# EAGLE design ArgentINOedge_v2 (EAGLE 6.6.0)
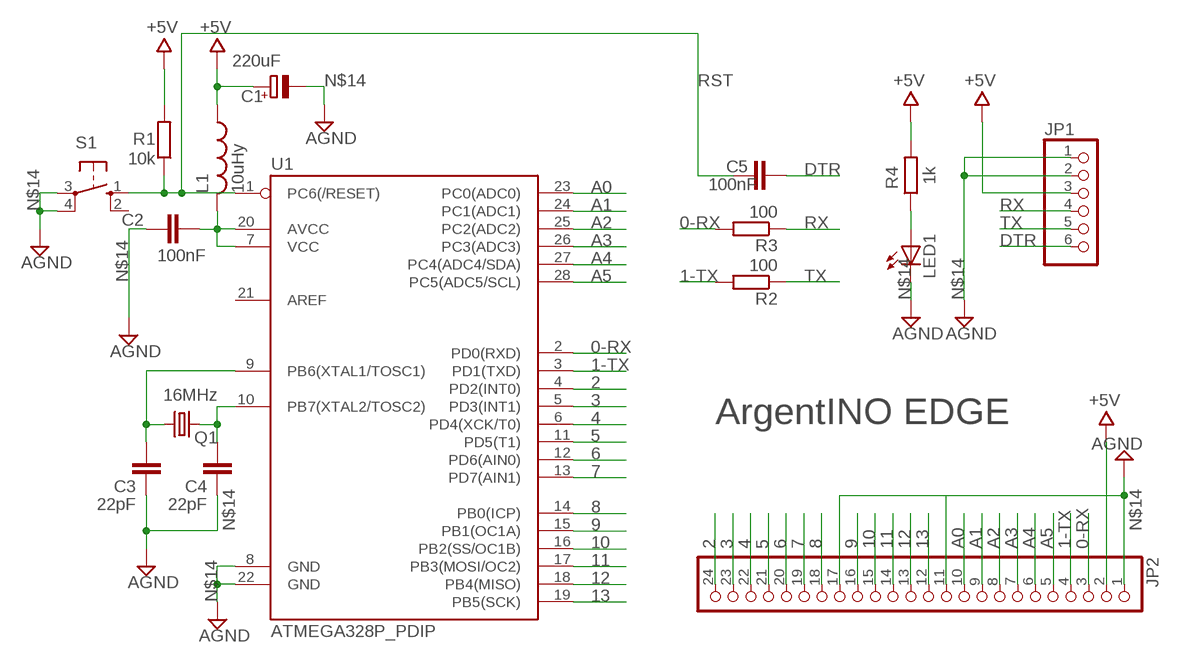
[diagram p0: schematic, sheet 1]

## Parts
C1  220uF  CPOL-EUE3.5-8  [E3,5-8]
C2  100nF  C-EU050-024X044  [C050-024X044]
C3  22pF  C-EU025-025X050  [C025-025X050]
C4  22pF  C-EU025-025X050  [C025-025X050]
C5  100nF  C-EU050-024X044  [C050-024X044]
JP1  PINHD-1X6  [1X06]
JP2  PINHD-1X24  [1X24]
L1  10uHy  L-US0204/7  [0204/7]
LED1  LED3MM  [LED3MM]
Q1  16MHz  CRYSTALHC49S  [HC49/S]
R1  10k  R-EU_0204/7  [0204/7]
R2  100  R-EU_0204/7  [0204/7]
R3  100  R-EU_0204/7  [0204/7]
R4  1k  R-EU_0204/7  [0204/7]
S1  10-XX  [B3F-10XX]
U1  ATMEGA328P_PDIP  [DIL28-3]

## Nets
0-RX: JP2.3 R3.2 U1.2(PD0(RXD))
1-TX: JP2.4 R2.2 U1.3(PD1(TXD))
2: JP2.24 U1.4(PD2(INT0))
3: JP2.23 U1.5(PD3(INT1))
4: JP2.22 U1.6(PD4(XCK/T0))
5: JP2.21 U1.11(PD5(T1))
6: JP2.20 U1.12(PD6(AIN0))
7: JP2.19 U1.13(PD7(AIN1))
8: JP2.18 U1.14(PB0(ICP))
9: JP2.16 U1.15(PB1(OC1A))
10: JP2.15 U1.16(PB2(SS/OC1B))
11: JP2.14 U1.17(PB3(MOSI/OC2))
12: JP2.13 U1.18(PB4(MISO))
13: JP2.12 U1.19(PB5(SCK))
+5V: C1.+ JP1.3 JP2.2 L1.1 R1.2 R4.2
A0: JP2.10 U1.23(PC0(ADC0))
A1: JP2.9 U1.24(PC1(ADC1))
A2: JP2.8 U1.25(PC2(ADC2))
A3: JP2.7 U1.26(PC3(ADC3))
A4: JP2.6 U1.27(PC4(ADC4/SDA))
A5: JP2.5 U1.28(PC5(ADC5/SCL))
DTR: C5.1 JP1.6
N$1: C3.2 Q1.2 U1.9(PB6(XTAL1/TOSC1))
N$2: C4.2 Q1.1 U1.10(PB7(XTAL2/TOSC2))
N$3: C2.1 L1.2 U1.7(VCC) U1.20(AVCC)
N$14: C1.- C2.2 C3.1 C4.1 JP1.1 JP1.2 JP2.1 JP2.11 JP2.17 LED1.K(C) S1.3(P) S1.4(P1) U1.8(GND) U1.22(GND) ; supply symbol labelled AGND
N$40: LED1.A R4.1
RST: C5.2 R1.1 S1.1(S) U1.1(PC6(/RESET))
RX: JP1.4 R3.1
TX: JP1.5 R2.1
Unconnected: S1.2(S1) U1.21(AREF)

## Notes on the sheet
- ArgentINO EDGE

## Library data of the parts
C1 = rcl:CPOL-EU: POLARIZED CAPACITOR, European symbol
C2-C5 = rcl:C-EU: CAPACITOR, European symbol
JP1 = pinhead:PINHD-1X6: PIN HEADER
JP2 = pinhead:PINHD-1X24: PIN HEADER
L1 = rcl:L-US: INDUCTOR, American symbol
LED1 = led:LED: LED OSRAM: - CHIPLED LG R971, LG N971, LY N971, LG Q971, LY Q971, LO R971, LY R971 LH N974, LH R974 LS Q976, LO Q976, LY Q976 LO Q996 - Hyper CHIPLED LW Q18S LB Q993, LB Q99A, LB R99A - SideLED LS A670, LO A670, LY A670, LG A670, LP A670 LB A673, LV A673, LT A673, LW A673 LH A674 LY A675 LS A676, LA A676, LO A676, LY A676, LW A676 LS A679, LY A679, LG A679 - Hyper Micro SIDELED® LS Y876, LA Y876, LO Y876, LY Y876 LT Y87S - SmartLED LW L88C, LW L88S LB L89C, LB L89S, LG L890 LS L89K, LO L89K, LY L89K LS L896, LA L896, LO L896, LY L896 - TOPLED LS T670, LO T670, LY T670, LG T670, LP T670 LSG T670, LSP T670, LSY T670, LOP T670, LYG T670 LG T671, LOG T671, LSG T671 LB T673, LV T673, LT T673, LW T673 LH T674 LS T676, LA T676, LO T676, LY T676, LB T676, LH T676, LSB T676, LW T676 LB T67C, LV T67C, LT T67C, LS T67K, LO T67K, LY T67K, LW E67C LS E67B, LA E67B, LO E67B, LY E67B, LB E67C, LV E67C, LT E67C LW T67C LS T679, LY T679, LG T679 LS T770, LO T770, LY T770, LG T770, LP T770 LB T773, LV T773, LT T773, LW T773 LH T774 LS E675, LA E675, LY E675, LS T675 LS T776, LA T776, LO T776, LY T776, LB T776 LHGB T686 LT T68C, LB T68C - Hyper Mini TOPLED® LB M676 - Mini TOPLED Santana® LG M470 LS M47K, LO M47K, LY M47K Source: http://www.osram.convergy.de LUXEON: - LUMILED® LXK2-PW12-R00, LXK2-PW12-S00, LXK2-PW14-U00, LXK2-PW14-V00 LXK2-PM12-R00, LXK2-PM12-S00, LXK2-PM14-U00 LXK2-PE12-Q00, LXK2-PE12-R00, LXK2-PE12-S00, LXK2-PE14-T00, LXK2-PE14-U00 LXK2-PB12-K00, LXK2-PB12-L00, LXK2-PB12-M00, LXK2-PB14-N00, LXK2-PB14-P00, LXK2-PB14-Q00 LXK2-PR12-L00, LXK2-PR12-M00, LXK2-PR14-Q00, LXK2-PR14-R00 LXK2-PD12-Q00, LXK2-PD12-R00, LXK2-PD12-S00 LXK2-PH12-R00, LXK2-PH12-S00 LXK2-PL12-P00, LXK2-PL12-Q00, LXK2-PL12-R00 Source: www.luxeon.com KINGBRIGHT: KA-3528ASYC Source: www.kingbright.com
Q1 = crystal:CRYSTAL: CRYSTAL; OC_FARNELL: 1667008; OC_NEWARK: unknown
R1-R4 = rcl:R-EU_: RESISTOR, European symbol
S1 = switch-omron:10-XX: OMRON SWITCH; MPN: B3F-1000; OC_FARNELL: 176432; OC_NEWARK: 36M3542
U1 = SparkFun-DigitalIC:ATMEGA328P_PDIP: uC used in the Arduino 32kb flash, 1k EEPROM, 2k SRAM This is the through-hole version of this chip.

## Board
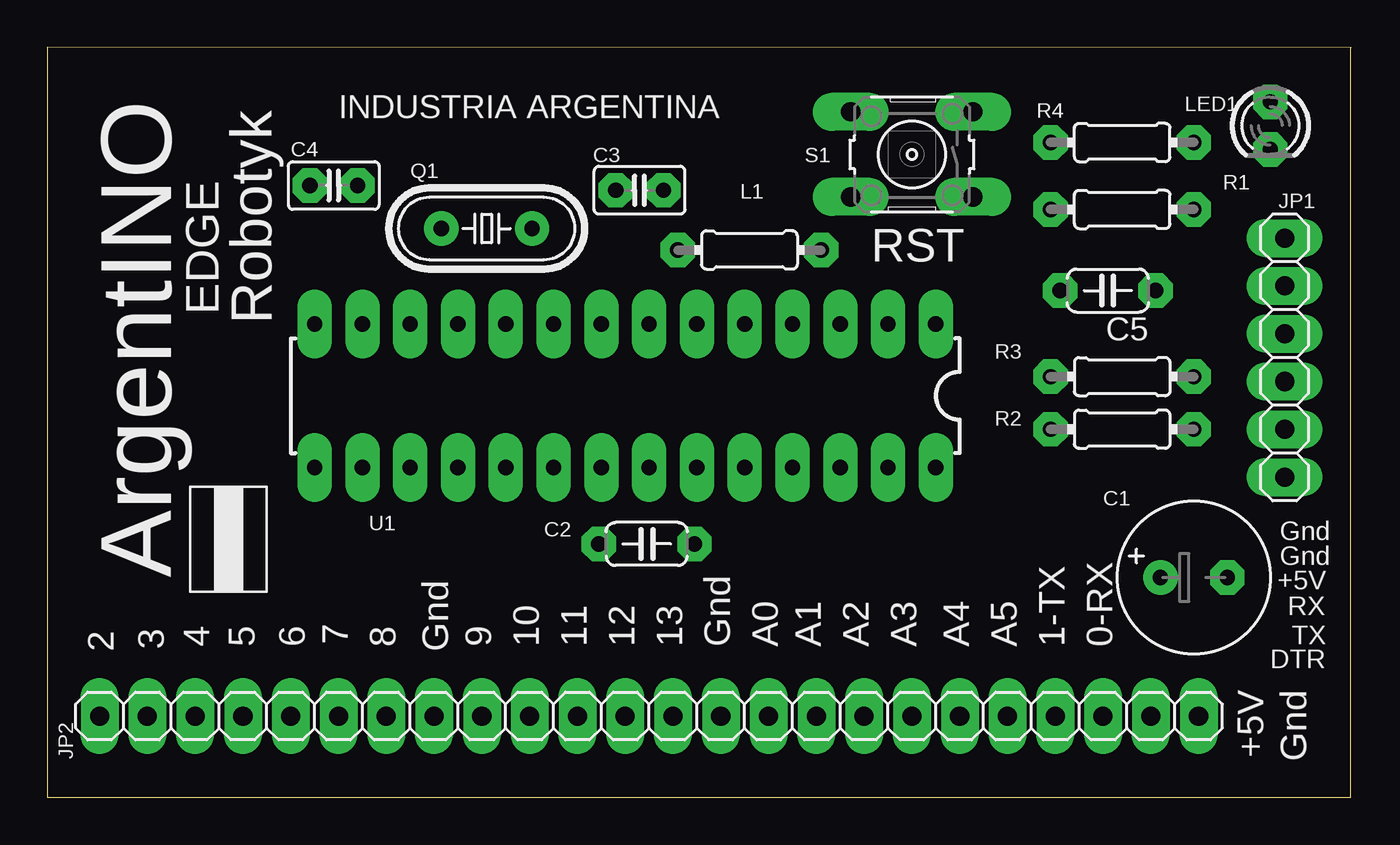
[diagram p1: board, top side]
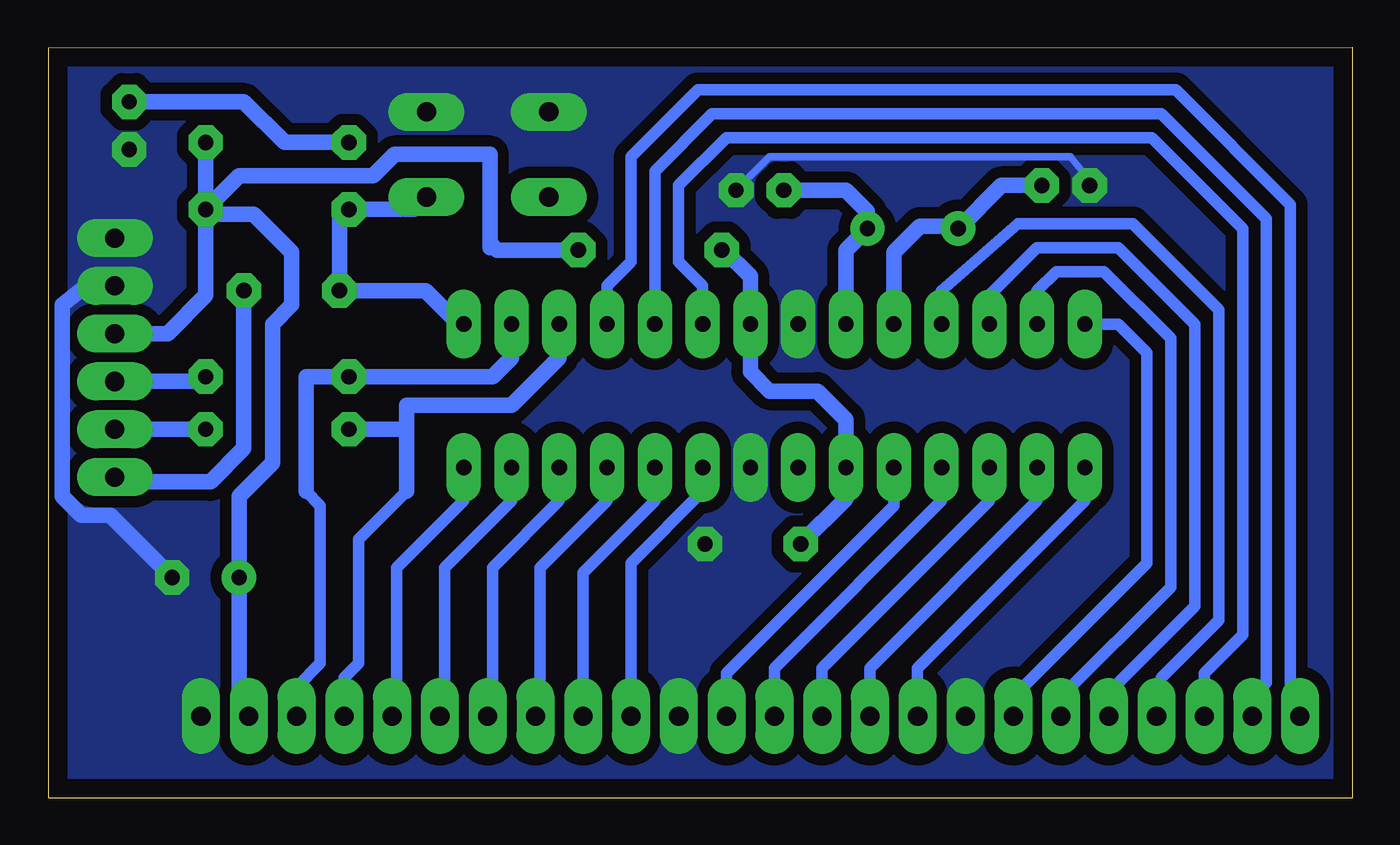
[diagram p2: board, bottom side, seen from below]

Size 69.32 x 39.88 mm. Coordinates in mm from the lower left corner, seen from the top.
Outline: 69.3,39.85 69.3,0 0,0 0,39.88 69.32,39.85
Copper layers (1*16): Top 0.035mm / dielectric 1.5mm / Bottom 0.035mm
Design rules "default *": minimum track width 10mil, minimum drill 24mil, track to track 8mil, track to pad 8mil, pad to pad 8mil, via to via 8mil, smd to smd 8mil, copper to edge 40mil, drill to drill 8mil, minimum pad ring 20mil, minimum via ring 8mil, stop-mask expansion 4mil, vias tented up to drill 0mil, thermal gap 20mil

### Footprints (pad centres in the part's own frame; a part is rotated, then mirrored left to right if it is on the bottom)
E3,5-8 = drill 0.813 pad 1.6: + -1.778,0 | drill 0.813 pad 1.6 octagon: - 1.778,0
C050-024X044 = drill 0.813 octagon: 1 -2.54,0; 2 2.54,0
C025-025X050 = drill 0.813 octagon: 1 -1.27,0; 2 1.27,0
1X06 = drill 1.016 long: 1 -6.35,0; 2 -3.81,0; 3 -1.27,0; 4 1.27,0; 5 3.81,0; 6 6.35,0
1X24 = drill 1.016 long: 1 -29.21,0; 2 -26.67,0; 3 -24.13,0; 4 -21.59,0; 5 -19.05,0; 6 -16.51,0; 7 -13.97,0; 8 -11.43,0; 9 -8.89,0; 10 -6.35,0; 11 -3.81,0; 12 -1.27,0; 13 1.27,0; 14 3.81,0; 15 6.35,0; 16 8.89,0; 17 11.43,0; 18 13.97,0; 19 16.51,0; 20 19.05,0; 21 21.59,0; 22 24.13,0; 23 26.67,0; 24 29.21,0
0204/7 = drill 0.813 octagon: 1 -3.81,0; 2 3.81,0
LED3MM = drill 0.813 octagon: A -1.27,0; K 1.27,0
HC49/S = drill 0.813: 1 -2.413,0; 2 2.413,0
B3F-10XX = drill 1.016 long: 1 -3.251,2.261; 2 3.251,2.261; 3 -3.251,-2.261; 4 3.251,-2.261
DIL28-3 = drill 0.813 long: 1 -16.51,-3.81; 2 -13.97,-3.81; 3 -11.43,-3.81; 4 -8.89,-3.81; 5 -6.35,-3.81; 6 -3.81,-3.81; 7 -1.27,-3.81; 8 1.27,-3.81; 9 3.81,-3.81; 10 6.35,-3.81; 11 8.89,-3.81; 12 11.43,-3.81; 13 13.97,-3.81; 14 16.51,-3.81; 15 16.51,3.81; 16 13.97,3.81; 17 11.43,3.81; 18 8.89,3.81; 19 6.35,3.81; 20 3.81,3.81; 21 1.27,3.81; 22 -1.27,3.81; 23 -3.81,3.81; 24 -6.35,3.81; 25 -8.89,3.81; 26 -11.43,3.81; 27 -13.97,3.81; 28 -16.51,3.81

### Placement (x,y rotation side)
C1  60.96,11.69 0 top
C2  31.88,13.47 0 top
C3  31.5,32.27 180 top
C4  15.24,32.52 0 top
C5  56.39,26.93 180 top
JP1  65.79,23.38 270 top
JP2  32,4.33 180 top
L1  37.34,29.09 180 top
LED1  65.02,35.7 270 top
Q1  23.37,30.24 0 top
R1  57.15,31.25 0 top
R2  57.15,19.57 180 top
R3  57.15,22.36 180 top
R4  57.15,34.81 0 top
S1  45.97,34.17 180 top
U1  30.73,21.35 180 top

### Tracks (layer width: path | path; a pad name or v marks a point on that pad's centre or on a via)
0-RX
  Bottom 0.61: 55.63,16.27 54.86,15.5 54.86,7.12 56.13,5.85 JP2.3
  Bottom 0.813: U1.2 44.7,23.38 45.72,22.36 R3.2 55.63,22.36 55.63,16.27
1-TX
  Bottom 0.61: JP2.4 53.59,6.36 52.83,7.12 52.83,13.73 50.29,16.27
  Bottom 0.813: U1.3 42.16,23.38 44.7,20.84 50.29,20.84 50.29,19.57 | 50.29,19.57 R2.2 | 50.29,16.27 50.29,19.57
2
  Bottom 0.61: U1.4 39.62,27.19 38.35,28.46 38.35,34.05 34.8,37.6 9.4,37.6 3.3,31.51 3.3,5.85 2.79,5.34 JP2.24
3
  Bottom 0.61: JP2.23 5.59,5.34 4.57,6.11 4.57,30.74 10.16,36.33 34.04,36.33 37.08,33.28 U1.5
4
  Bottom 0.61: JP2.22 7.87,6.61 5.84,8.65 5.84,30.24 10.67,35.06 33.27,35.06 35.81,32.52 35.81,28.46 34.54,27.19 U1.6
5
  Bottom 0.61: U1.11 21.84,26.93 17.78,30.49 11.68,30.49 7.11,25.92 7.11,9.41 10.16,6.36 10.41,5.6 JP2.21
6
  Bottom 0.61: U1.12 19.3,26.68 16.76,29.22 12.45,29.22 8.38,25.16 8.38,10.17 12.95,5.6 JP2.20
7
  Bottom 0.61: U1.13 16.76,26.93 15.75,27.95 13.21,27.95 9.65,24.39 9.65,11.19 15.49,5.34 JP2.19
8
  Bottom 0.61: U1.14 12.45,25.16 10.92,23.63 10.92,12.46 18.03,5.34 JP2.18
9
  Bottom 0.61: U1.15 14.22,15.76 23.11,6.87 JP2.16
10
  Bottom 0.61: U1.16 16.76,15.76 25.65,6.87 JP2.15
11
  Bottom 0.61: U1.17 19.3,15.76 28.19,6.87 JP2.14
12
  Bottom 0.61: U1.18 21.84,15.76 30.73,6.87 JP2.13
13
  Bottom 0.61: U1.19 24.38,15.5 33.27,6.61 JP2.12
+5V
  Bottom 0.813: R4.2 R1.2 | 45.85,29.22 45.85,29.47 | 45.85,29.47 45.85,34.17 50.93,34.17 52.07,33.03 59.18,33.03 R1.2 | L1.1 45.47,29.09 45.85,29.47 | JP2.2 59.18,4.84 C1.+ 59.18,16.01 57.4,17.79 57.4,25.16 56.39,26.17 56.39,28.97 58.42,31 60.71,31 R1.2 | JP1.3 62.99,24.65 60.96,26.68 R1.2
A0
  Bottom 0.61: U1.23 34.54,16.27 38.35,12.46 JP2.10
A1
  Bottom 0.61: U1.24 37.08,15.76 40.89,11.95 JP2.9
A2
  Bottom 0.61: U1.25 39.62,15.76 43.18,12.2 43.18,4.58 JP2.8
A3
  Bottom 0.61: U1.26 42.16,15.76 45.72,12.2 45.72,4.58 JP2.7
A4
  Bottom 0.61: U1.27 44.7,15.76 48.26,12.2 48.26,4.58 JP2.6
A5
  Bottom 0.61: U1.28 47.24,15.76 50.8,12.2 50.8,4.58 JP2.5
DTR
  Bottom 0.813: C5.1 58.93,18.55 60.71,16.77 65.53,16.77 JP1.6
N$1
  Bottom 0.813: C3.2 26.92,32.27 25.78,31.12 Q1.2 26.92,29.09 U1.9
N$2
  Bottom 0.61: Q1.1 20.95,30.36
  Bottom 0.813: 20.95,30.36 22.99,30.36 24.38,28.97 U1.10 | C4.2 18.67,32.52 Q1.1
N$3
  Bottom 0.813: L1.2 33.4,29.09 32,27.7 U1.7 32,22.62 30.99,21.6 28.45,21.6 26.92,20.08 U1.20 26.92,15.88 C2.1
N$14
  Bottom 0.406: C4.1 13.97,32.78 14.99,34.05 30.99,34.05 C3.1
  Bottom 0.813: JP1.2 67.31,27.19 68.58,26.17 68.58,16.01 67.56,15 66.04,15 C1.-
  pour Bottom (isolate 0.61, no thermals): 0,39.76 69.21,39.76 69.21,0.01 0,0.01
N$40
  Bottom 0.813: R4.1 56.77,34.81 58.93,36.97 LED1.A
RST
  Bottom 0.813: U1.1 47.5,25.16 49.28,26.93 C5.2 53.85,30.74 R1.1 49.89,31.25 S1.1
RX
  Bottom 0.813: JP1.4 60.96,22.11 R3.1
S$1
  Bottom 0.61: 50.8,4.58 51.05,4.33
S$4
  Bottom 0.61: 33.27,4.33 33.27,6.36
S$10
  Bottom 0.61: 48.26,4.58 48.51,4.33
S$16
  Bottom 0.61: 43.18,4.58 43.43,4.33
S$18
  Bottom 0.61: 45.72,4.58 45.97,4.33
TX
  Bottom 0.813: JP1.5 R2.1

### Text on the board
tNames: INDUSTRIA ARGENTINA | RST | EDGE | Robotyk | Gnd | Gnd | ArgentINO | +5V | RX | TX | 2 | 3 | 4 | 5 | 6 | 7 | 8 | Gnd | 9 | 10 | 11 | 12 | 13 | Gnd | A0 | A1 | A2 | A3 | A4 | A5 | 1-TX | 0-RX | DTR | +5V | Gnd